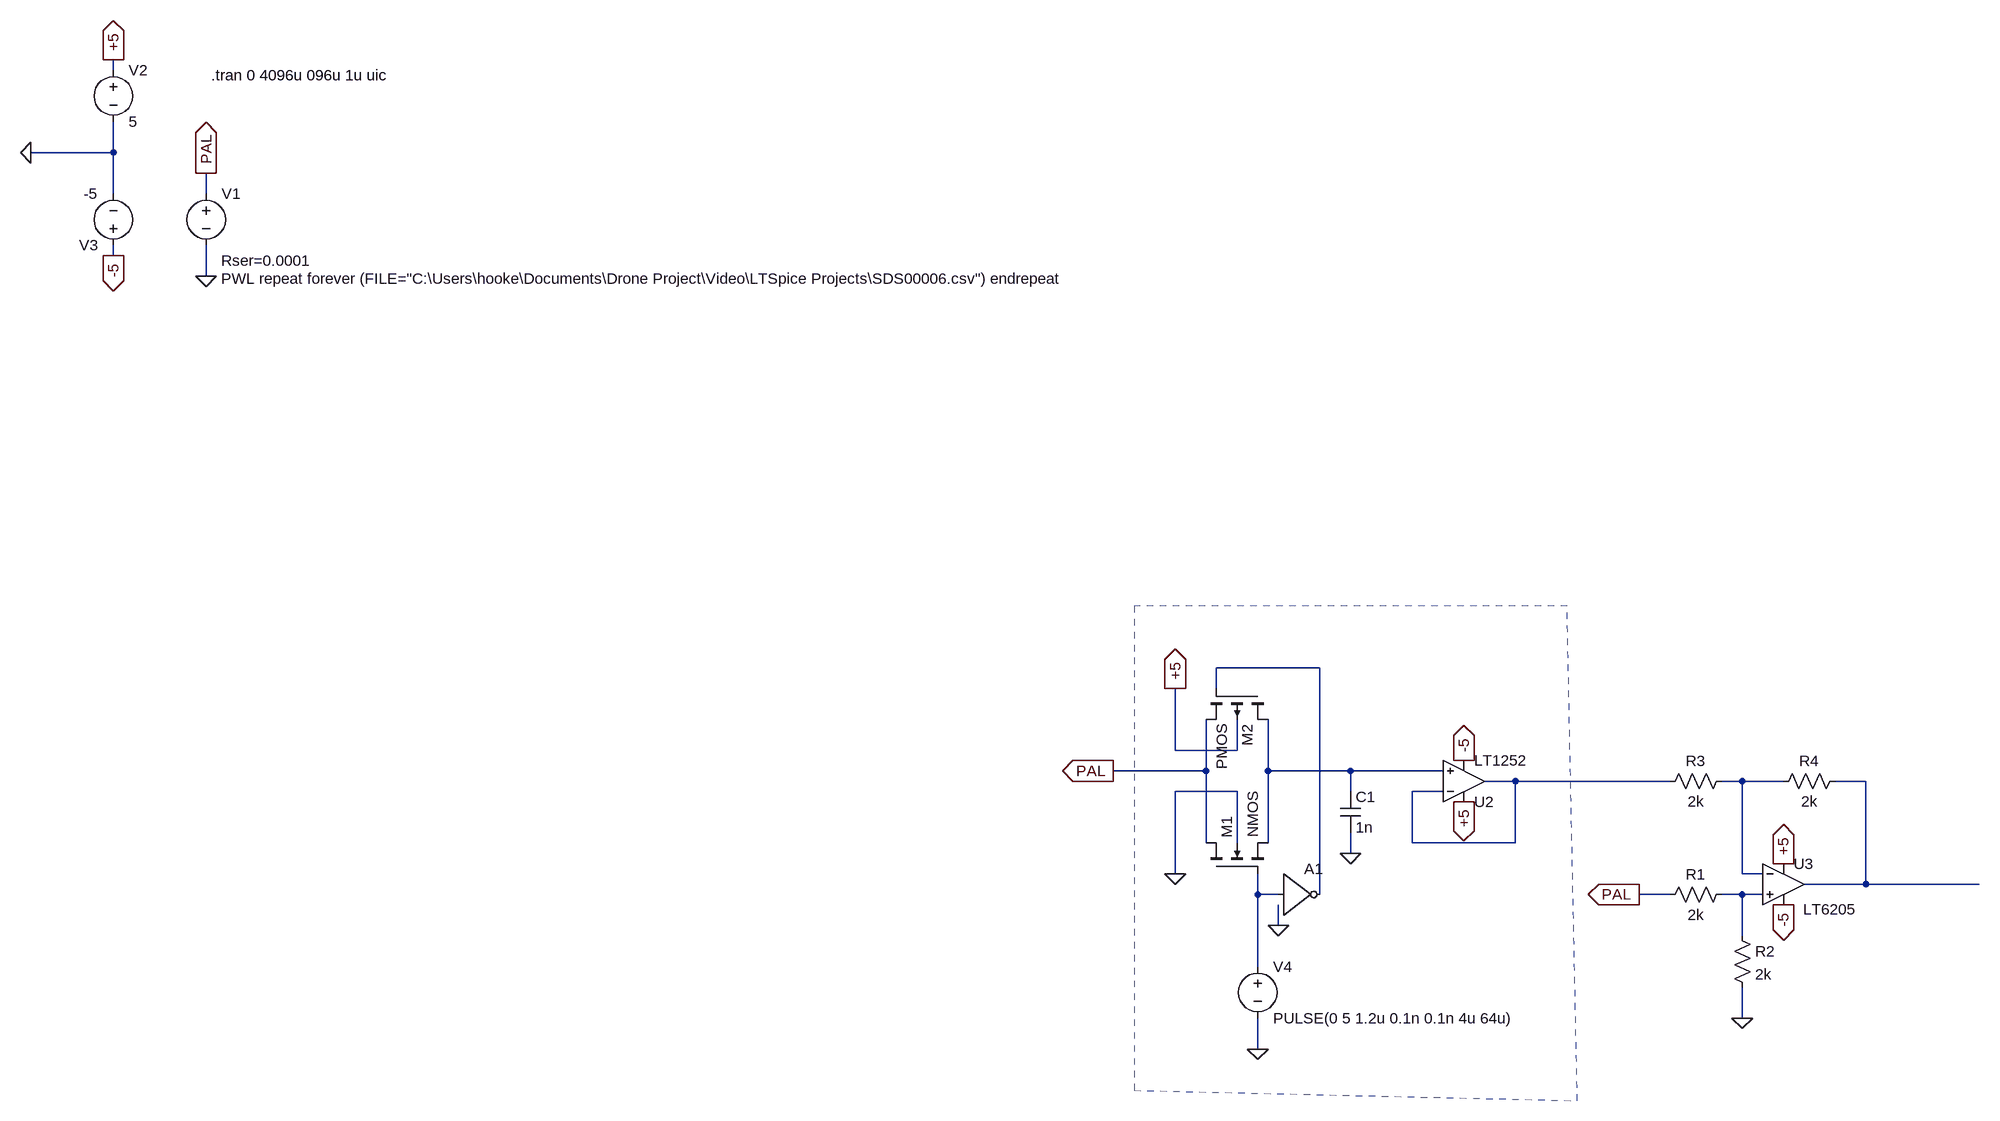
[diagram p0: schematic Draft3.asc]
Draft3.asc, the LTspice schematic file:
Version 4
SHEET 1 1560 1064
WIRE -1712 -608 -1712 -624
WIRE -1712 -480 -1712 -528
WIRE -1712 -480 -1840 -480
WIRE -1712 -416 -1712 -480
WIRE -1568 -416 -1568 -448
WIRE -1712 -320 -1712 -336
WIRE -1568 -288 -1568 -336
WIRE 160 320 0 320
WIRE 0 352 0 320
WIRE -64 448 -64 352
WIRE 32 448 32 400
WIRE 32 448 -64 448
WIRE -16 480 -16 400
WIRE -16 480 -160 480
WIRE 80 480 80 400
WIRE 208 480 80 480
WIRE 352 480 208 480
WIRE 464 496 416 496
WIRE 704 496 464 496
WIRE 816 496 784 496
WIRE 880 496 816 496
WIRE 1008 496 960 496
WIRE 32 512 -64 512
WIRE 208 512 208 480
WIRE 352 512 304 512
WIRE -16 592 -16 480
WIRE 32 592 32 512
WIRE 80 592 80 480
WIRE 304 592 304 512
WIRE 464 592 464 496
WIRE 464 592 304 592
WIRE 208 608 208 576
WIRE -64 640 -64 512
WIRE 816 640 816 496
WIRE 848 640 816 640
WIRE 1008 656 1008 496
WIRE 1008 656 912 656
WIRE 1184 656 1008 656
WIRE 64 672 64 640
WIRE 96 672 64 672
WIRE 160 672 160 320
WIRE 704 672 656 672
WIRE 816 672 784 672
WIRE 848 672 816 672
WIRE 96 720 96 688
WIRE 816 736 816 672
WIRE 64 784 64 672
WIRE 816 864 816 816
WIRE 64 912 64 864
FLAG -1568 -448 PAL
IOPIN -1568 -448 Out
FLAG -1568 -288 0
FLAG -1712 -624 +5
IOPIN -1712 -624 Out
FLAG -1712 -320 -5
IOPIN -1712 -320 Out
FLAG -1840 -480 0
FLAG -64 640 0
FLAG -64 352 +5
IOPIN -64 352 Out
FLAG 880 624 +5
IOPIN 880 624 Out
FLAG 880 688 -5
IOPIN 880 688 Out
FLAG 64 912 0
FLAG 96 720 0
FLAG 208 608 0
FLAG 656 672 PAL
IOPIN 656 672 Out
FLAG 384 528 +5
IOPIN 384 528 Out
FLAG 384 464 -5
IOPIN 384 464 Out
FLAG 816 864 0
FLAG -160 480 PAL
IOPIN -160 480 Out
SYMBOL voltage -1568 -432 R0
WINDOW 39 23 120 Left 2
WINDOW 3 23 148 Left 2
SYMATTR SpiceLine Rser=0.0001
SYMATTR Value PWL repeat forever (FILE="C:\Users\hooke\Documents\Drone Project\Video\LTSpice Projects\SDS00006.csv") endrepeat
SYMATTR InstName V1
SYMBOL voltage -1712 -624 R0
WINDOW 123 0 0 Left 0
WINDOW 39 0 0 Left 0
SYMATTR InstName V2
SYMATTR Value 5
SYMBOL voltage -1712 -320 R180
WINDOW 123 0 0 Left 0
WINDOW 39 0 0 Left 0
SYMATTR InstName V3
SYMATTR Value -5
SYMBOL nmos4 -16 640 R270
SYMATTR InstName M1
SYMATTR Value2 l=0.6u w=0.6u
SYMBOL pmos4 80 352 R90
SYMATTR InstName M2
SYMATTR Value2 l=0.6u w=0.6u
SYMBOL Digital\\inv 96 608 R0
WINDOW 3 0 0 Invisible 0
SYMATTR Value Vhigh=5
SYMATTR InstName A1
SYMBOL voltage 64 768 R0
WINDOW 123 0 0 Left 0
WINDOW 39 0 0 Left 0
SYMATTR InstName V4
SYMATTR Value PULSE(0 5 1.2u 0.1n 0.1n 4u 64u)
SYMBOL cap 192 512 R0
SYMATTR InstName C1
SYMATTR Value 1n
SYMBOL Opamps\\LT1252 384 560 M180
SYMATTR InstName U2
SYMBOL res 800 656 R90
WINDOW 0 0 56 VBottom 2
WINDOW 3 32 56 VTop 2
SYMATTR InstName R1
SYMATTR Value 2k
SYMBOL res 800 720 R0
SYMATTR InstName R2
SYMATTR Value 2k
SYMBOL res 800 480 R90
WINDOW 0 0 56 VBottom 2
WINDOW 3 32 56 VTop 2
SYMATTR InstName R3
SYMATTR Value 2k
SYMBOL res 976 480 R90
WINDOW 0 0 56 VBottom 2
WINDOW 3 32 56 VTop 2
SYMATTR InstName R4
SYMATTR Value 2k
SYMBOL Opamps\\LT6205 880 656 R0
WINDOW 3 31 39 Left 2
SYMATTR InstName U3
TEXT -1560 -600 Left 2 !.tran 0 4096u 096u 1u uic
LINE Normal 544 224 -128 224 2
LINE Normal 560 992 544 224 2
LINE Normal -128 976 560 992 2
LINE Normal -128 224 -128 976 2
LINE Normal -128 224 -128 224 2

The netlist it stands for:
* Draft3.asc
V1 PAL 0 PWL repeat forever (FILE="C:\Users\hooke\Documents\Drone Project\Video\LTSpice Projects\SDS00006.csv") endrepeat Rser=0.0001
V2 +5 0 5
V3 -5 0 -5
M1 PAL N006 N002 0 NMOS l=0.6u w=0.6u
M2 N002 N001 PAL +5 PMOS l=0.6u w=0.6u
A1 N006 0 0 0 0 N001 0 0 BUF Vhigh=5
V4 N006 0 PULSE(0 5 1.2u 0.1n 0.1n 4u 64u)
C1 N002 0 1n
XU2 N002 N003 +5 -5 N003 LT1252  ; pins In+ In- V+ V- OUT
R1 N007 PAL 2k
R2 N007 0 2k
R3 N004 N003 2k
R4 N005 N004 2k
* U3: LT6205 (symbol Opamps\LT6205 not available, pins judged from their places): In+=N007 In-=N004 V+=+5 V-=-5 OUT=N005
.model NMOS NMOS
.model PMOS PMOS
.lib standard.mos
.tran 0 4096u 096u 1u uic
.backanno
.end